# Altium schematic sheet Qunyin_mmWave_ESP32.SchDoc: mmWave_iwr6843aop
size 457 x 292 mm; DrawnBy: Wxd; Organization: Shanghai Qunyin; Address1: Xianxia Rd 601; Address2: Changning district; Address3: Shanghai; DocumentNumber: 5; SheetNumber: 5; SheetTotal: 6
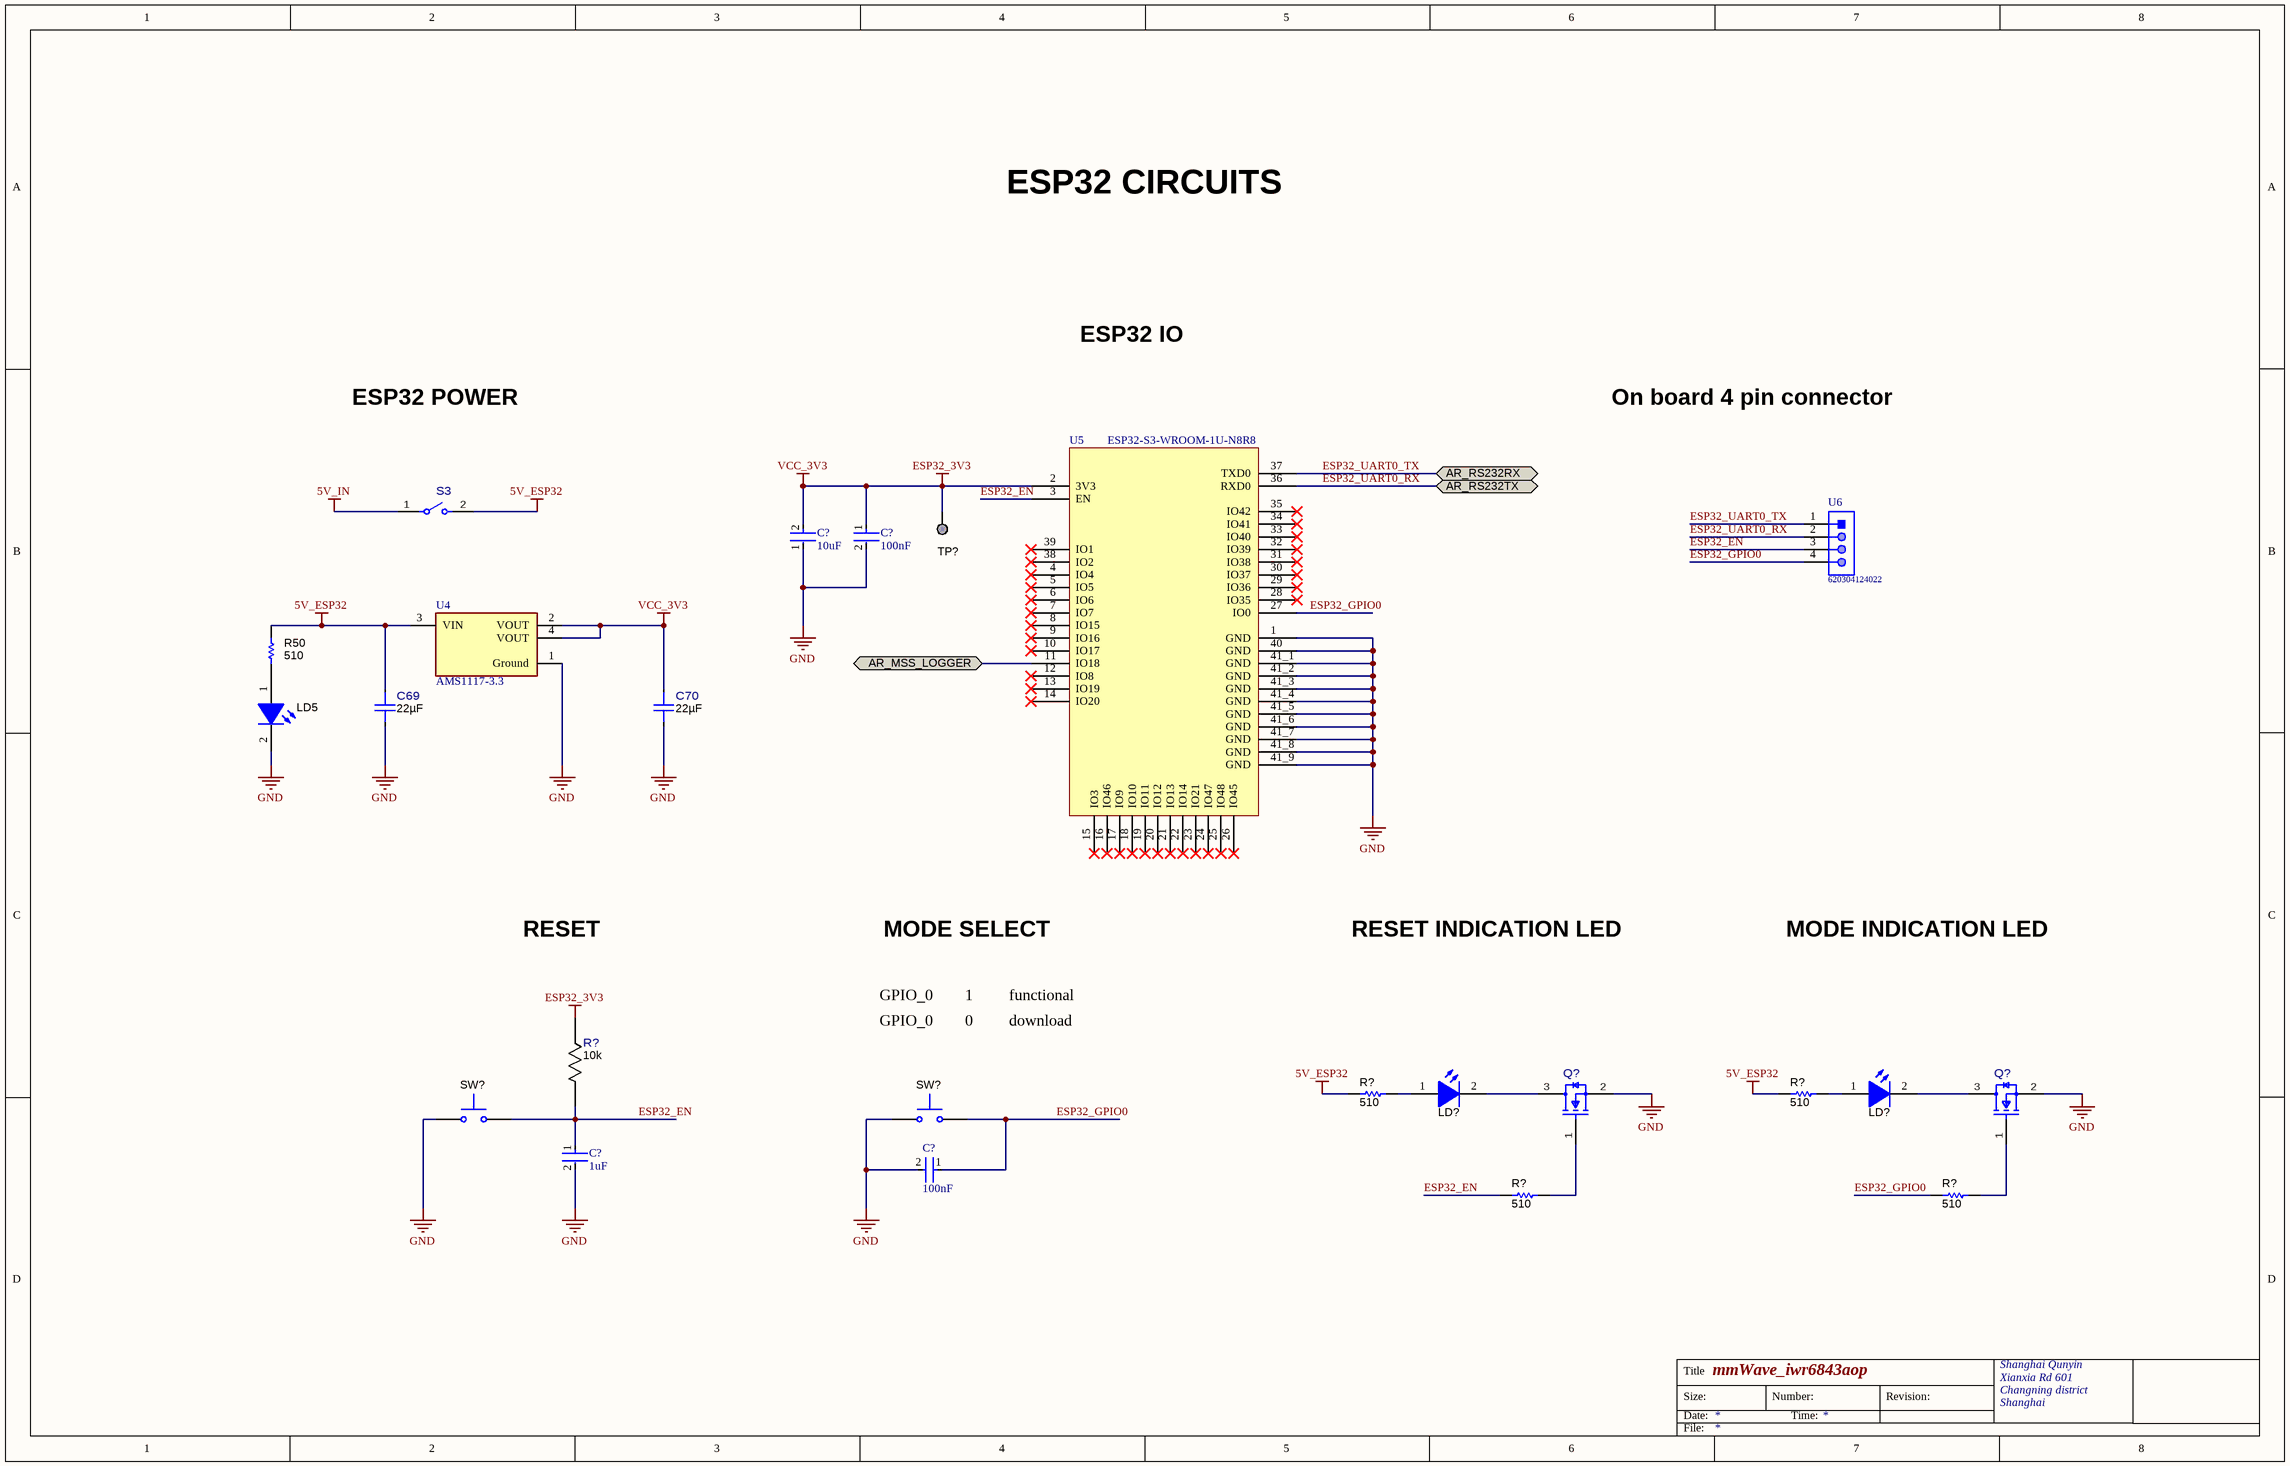
[diagram p0: Qunyin_mmWave_ESP32.SchDoc]

## Parts
(Parts that share a designator on the sheet are numbered #1, #2 ... from top to bottom, then left to right.)
C69  Cap_F: 22µF  [FP-CL05A226MQ5N6J8_0402-IPC_C]  (hidden comment: CL05A226MQ5N6J8)
C70  Cap_F: 22µF  [FP-CL05A226MQ5N6J8_0402-IPC_C]  (hidden comment: CL05A226MQ5N6J8)
C?#1  Capacitance: 10uF  [FP-C1608-080-0_1-MFG]  (hidden comment: C1608X5R1A106K080AC)
C?#2  Capacitance: 100nF  [FP-C1005-050-0_05-IPC_C]  (hidden comment: C1005X7R1H104K050BB)
C?#3  Capacitance: 1uF  [FP-0603-L_1_6_0_1-W_0_8_0-IPC_A]  (hidden comment: TMK107B7105KA-T)
C?#4  Capacitance: 100nF  [FP-C1005-050-0_05-IPC_C]  (hidden comment: C1005X7R1H104K050BB)
LD5  APHHS1005CGCK  [APHHS1005_Green]  (value not drawn)
LD?#1  APHHS1005CGCK  [APHHS1005_Green]  (value not drawn)
LD?#2  APHHS1005CGCK  [APHHS1005_Green]  (value not drawn)
Q?#1  BSS123-7-F  [FP-BSS123-7-F_SOT23-IPC_C]  (value not drawn)
Q?#2  BSS123-7-F  [FP-BSS123-7-F_SOT23-IPC_C]  (value not drawn)
R50  value 510  [0201L]  (hidden comment: RC0201JR-07510RL)
R?#1  Res_ohm: 10k  [FP-RR0306P-103-D_0201-IPC_C]  (hidden comment: RR0306P-103-D)
R?#2  value 510  [0201L]  (hidden comment: RC0201JR-07510RL)
R?#3  value 510  [0201L]  (hidden comment: RC0201JR-07510RL)
R?#4  value 510  [0201L]  (hidden comment: RC0201JR-07510RL)
R?#5  value 510  [0201L]  (hidden comment: RC0201JR-07510RL)
S3  CHS-01TA  [FP-CHS-01TA_SMT_SW_5MM4_2MM5-MFG]  (value not drawn)
SW?#1  B3U-1000P  [SW_B3U-1000P]  (value not drawn)
SW?#2  B3U-1000P  [SW_B3U-1000P]  (value not drawn)
TP?  TESTPOINT  [TP_25MIL-SMT]  (value not drawn)  (no BOM)
U4  AMS1117-3.3  [FP-AMS1117-IPC_C]
U5  ESP32-S3-WROOM-1U-N8R8  [XCVR_ESP32-S3-WROOM-1U]
U6  620304124022  [620304124022]

## Ports
AR_MSS_LOGGER (bidir), AR_RS232RX (bidir), AR_RS232TX (bidir)

## Nets
5V_ESP32: C69.1 R50.1 R?#2.1 R?#3.1 S3.2 U4.3(VIN)
5V_IN: S3.1
ESP32_3V3: C70.1 C?#1.2 C?#2.1 R?#1.1 TP?.1 U4.2(VOUT) U4.4(VOUT) U5.2(3V3)  [also labelled VCC_3V3]
GND: C69.2 C70.2 C?#1.1 C?#2.2 C?#3.2 C?#4.2 LD5.2(K) Q?#1.2(S) Q?#2.2(S) SW?#1.2 SW?#2.2 U4.1(Ground) U5.1(GND) U5.40(GND) U5.41_1(GND) U5.41_2(GND) U5.41_3(GND) U5.41_4(GND) U5.41_5(GND) U5.41_6(GND) U5.41_7(GND) U5.41_8(GND) U5.41_9(GND)
AR_MSS_LOGGER: U5.11(IO18) ; port AR_MSS_LOGGER
ESP32_EN: C?#3.1 R?#1.2 R?#4.1 SW?#1.1 U5.3(EN) U6.3
ESP32_GPIO0: C?#4.1 R?#5.1 SW?#2.1 U5.27(IO0) U6.4
ESP32_UART0_RX: U5.36(RXD0) U6.2 ; port AR_RS232TX
ESP32_UART0_TX: U5.37(TXD0) U6.1 ; port AR_RS232RX
NetLD5_1: LD5.1(A) R50.2
NetLD?#1_1: LD?#1.1(A) R?#2.2
NetLD?#1_2: LD?#1.2(K) Q?#1.3(D)
NetLD?#2_1: LD?#2.1(A) R?#3.2
NetLD?#2_2: LD?#2.2(K) Q?#2.3(D)
NetQ?#1_1: Q?#1.1(G) R?#4.2
NetQ?#2_1: Q?#2.1(G) R?#5.2

Not connected (* = marked no-connect by the designer): U5 4(IO4)* 5(IO5)* 6(IO6)* 7(IO7)* 8(IO15)* 9(IO16)* 10(IO17)* 12(IO8)* 13(IO19)* 14(IO20)* 15(IO3)* 16(IO46)* 17(IO9)* 18(IO10)* 19(IO11)* 20(IO12)* 21(IO13)* 22(IO14)* 23(IO21)* 24(IO47)* 25(IO48)* 26(IO45)* 28(IO35)* 29(IO36)* 30(IO37)* 31(IO38)* 32(IO39)* 33(IO40)* 34(IO41)* 35(IO42)* 38(IO2)* 39(IO1)*

## Notes on the sheet
- ESP32 CIRCUITS
- ESP32 IO
- ESP32 POWER
- On board 4 pin connector
- RESET
- MODE SELECT
- RESET INDICATION LED
- MODE INDICATION LED
- GPIO_0        1         functional
- GPIO_0        0         download
- Title
- Size:
- Date:
- Number:
- Time:
- Revision:
- File:

## Library data of the parts
C69 C70 = CMP-0089043-3: CAP CER 22UF 6.3V X5R 0402; Manufacturer: Samsung Electro-Mechanics; TempCo: 15%; AEC Qualified: No; Tolerance_%: 20%; SizeZ_mm: 0.55mm; ComponentLink1URL: http://www.samsungsem.com/kr/support/library/product-catalog/__icsFiles/afieldfile/2018/11/28/MLCC.pdf; RoHS: TRUE; PartNumber: CL05A226MQ5N6J8; ComponentLink1Description: Datasheet; PackageReference: 0402; VDC_V: 6.3V; ValueDisplayed: 22uF; Part Number: CL05A226MQ5N6J8
C?#1 = CMP-2000-04979-3: Multilayer Ceramic Capacitors 10μF ±10% 10V X5R SMD 0603; Dielectric Material: Ceramic; Construction: Flat; Height: 0.8mm; Thickness: 0.035inch; Case Code (Metric): 1608; Radiation Hardening: No; Number of Pins: 2; Voltage Rating (DC): 10V; Depth: 0.8mm; Voltage: 10V; RoHS Compliant: Yes; Voltage Rating: 10V; Package Quantity: 1; Resistor Type: Ceramic; Termination: SMD/SMT; Lead Free: Lead Free; REACH SVHC: No SVHC; Tolerance: 10%; Mount: Surface Mount; Series: C; Packaging: Tape and Reel; Width: 0.8mm; Dielectric: X5R; Weight: 7.1E-05oz; Length: 1.6mm; Max Operating Temperature: 85°C; Case Code (Imperial): 0603; Case/Package: 0603; Min Operating Temperature: -55°C
C?#2 C?#4 = CMP-2000-05393-2: Multilayer Ceramic Capacitors 100nF ±10% 50V X7R SMD 0402; Voltage: 50V; Dielectric Material: Ceramic; Min Operating Temperature: -55°C; Depth: 0.5mm; Radiation Hardening: No; RoHS Compliant: Yes; Voltage Rating (DC): 50V; Lead Free: Lead Free; Resistor Type: Ceramic; Height: 0.5mm; Dielectric: X7R; Thickness: 0.022inch; Case/Package: 0402; Case Code (Metric): 1005; Termination: SMD/SMT; Packaging: Tape and Reel; Max Operating Temperature: 125°C; Mount: Surface Mount; Package Quantity: 1; Width: 0.02inch; Weight: 2.3E-05oz; Voltage Rating: 50V; Tolerance: 10%; Construction: Flat; Case Code (Imperial): 0402; Length: 1mm; REACH SVHC: No SVHC; Series: C
C?#3 = CMP-2000-07259-3: None; Voltage Rating (DC): 25V; Dielectric: X7R; Tolerance: 10%; Height: 0.8mm; Case Code (Metric): 1608; Max Operating Temperature: 125°C; Case Code (Imperial): 0603; Case/Package: 0603; Resistor Type: Ceramic; Halogen Free: Halogen Free; Series: M; Voltage Rating: 25V; Number of Pins: 2; Depth: 0.8mm; RoHS Compliant: Yes; Mount: Surface Mount; Min Operating Temperature: -55°C; Length: 1.6mm; Contact Plating: Tin; Radiation Hardening: No; Width: 0.031inch; Construction: Flat; Thickness: 0.035inch; Packaging: Tape and Reel; Termination: SMD/SMT; REACH SVHC: No SVHC; Package Quantity: 1
LD5 LD?#1 LD?#2 = CMP-0067682-2: LED, Green, SMD; Manufacturer: Kingbright; Angle: 120.0; Power_TotalModule: 75mW; SizeZ_mm: 0.6; Vf_V: 2.1V; Vr_V: 5V; Io_A: 20mA; Ir_A: 10µA; SizeArea_mm2: 0.5; SizeAreaWB_mm2: 3.0; SizeX_mm: 1.0; Tjmax_C: 85°C; Value1: 0.075W; RoHS: Y; Color: Green; ComponentLink1Description: Datasheet link; ComponentLink1URL: http://www.kingbrightusa.com/images/catalog/SPEC/APHHS1005CGCK.pdf; PackageReference: 0402; PartNumber: APHHS1005CGCK; CompType: LED; MountType: SMT; SizeY_mm: 0.5; Type: ?; Value2: 2.1V; Value: Green
Q?#1 Q?#2 = CMP-0087176-1: MOSFET N-CH 100V 170MA SOT23-3; Manufacturer: Diodes Incorporated; AEC Qualified: No; ChMode: False; Rdson45_ohm: 6; SizeZ_mm: 1.1mm; Vgs_V: 20V; RoHS: TRUE; ComponentLink1Description: Datasheet; ComponentLink1URL: https://www.diodes.com/assets/Datasheets/ds30366.pdf; IdsMax_A: 170mA; PackageReference: SOT23; PartNumber: BSS123-7-F; Symbol Name: SYM-BSS123-7-F; VdsMax_V: 100V
R50 R?#2-R?#5 = CMP-0027137-1: RES, 510, 5%, 0.05 W, 0201; Manufacturer: Yageo America; AEC Category: Q200; AEC Qualified: N; EIA_Code: E24; Power_W: 50mW; SizeArea_mm2: 0.18; SizeX_mm: 0.6; SizeY_mm: 0.3; SizeZ_mm: 0.26; TempCo: 200 ppm/C; U/M: EA; Value2: 0.05W; Value_Code: 510R; VDC_V: 25V; RoHS: Y; AEC Grade: N/A; ComponentLink1Description: Datasheet link; ComponentLink1URL: http://www.yageo.com/documents/recent/PYu-RC_Group_51_RoHS_L_5.pdf; CompType: Resistor; LatestRevisionDate: 2017-03-09; MountType: SMT; PackageReference: 0201; PartNumber: RC0201JR-07510RL; Published: 2016-10-14; Publisher: Texas Instruments; Res_ohm: 510; Supplier 1: Digi-Key; Supplier 2: Mouser; Supplier Part Number 1: YAG2907CT-ND; Supplier Part Number 2: 603-RC0201JR-07510RL; Technology: Thick Film; Tolerance_%: 5%; Value1: 5%; ValueDisplayed: 510
R?#1 = CMP-0088002-1: 10 kOhms ±0.5% 0.05W, 1/20W Chip Resistor 0201 (0603 Metric)  Thin Film; Manufacturer: Susumu; AEC Qualified: No; Power_W: 50mW; SizeZ_mm: 0.26mm; Symbol Name: SYM-RR0306P-103-D; TempCo: 25ppm/°C; VDC_V: 15V; RoHS: TRUE; ComponentLink1Description: Datasheet; ComponentLink1URL: https://www.susumu.co.jp/common/pdf/n_catalog_partition05_en.pdf; PackageReference: 0201; PartNumber: RR0306P-103-D; Technology: Thin Film; Tolerance_%: 0.5%
S3 = CMP-0087181-1: SWITCH SLIDE DIP SPST 100MA 6V; Manufacturer: Nidec Copal Electronics; PositionCount: 1; SizeZ_mm: 2.5mm; Symbol Name: SYM-CHS-01TA; RoHS: TRUE; Circuit: SPST; ComponentLink1Description: Datasheet; ComponentLink1URL: https://www.nidec-copal-electronics.com/e/catalog/switch/chs.pdf; MountType: Surface Mount; PackageReference: SMT_SW_5MM4_2MM5; PartNumber: CHS-01TA; VDC_V: 6V
SW?#1 SW?#2 = CMP-0002150-2: SWITCH TACTILE SPST-NO 0.05A 12V; Manufacturer: Omron Electronic Components; CurrentRating_mA: 50A; PositionCount: 1; SwitchFunction: Off-Mom; RoHS: Y; Circuit: SPST-NO; ComponentLink1Description: Datasheet URL; ComponentLink1URL: http://www.components.omron.com/components/web/PDFLIB.nsf/0/2DD3893C7DD33E9E862572900079E9D6/$file/B3U_1110.pdf; CompType: Switch; LatestRevisionDate: 2017-03-09; MountType: SMT; Orientation: Top Actuated; PackageReference: 3x1.6x2.5mm; PartNumber: B3U-1000P; Publisher: Texas Instruments; Supplier 1: Digi-Key; Supplier 2: Newark; Supplier 3: Mouser; Supplier Part Number 1: SW1020CT-ND; Supplier Part Number 2: 34M5295; Supplier Part Number 3: 653-B3U-1000P; VDC_V: 12V
TP? = CMP-0078143-3: TEST POINT.  No entry in BOM.; CompType: Testpoint; Manufacturer: N/A; PackageReference: N/A; PartNumber: N/A; Library Reference: TESTPOINT
U4 = CMP-209535-000001-1: LDO Voltage Regulators 1A, 3.3V; Manufacturer: Advanced Monolithic Systems; Dropout Voltage: 1.1V; Output Type: Fixed; Nominal Supply Current: 5mA; Max Power Dissipation: 1.2W; Max Supply Voltage: 15V; Number Of Outputs: 1; Standoff Height: 0.64mm; Max Junction Temp: +125°C; Height: 1.8mm; Package: AMS1117; Device Class L2: Power Management ICs; ComponentLink2Description: Datasheet; ComponentLink2URL: http://www.advanced-monolithic.com/pdf/ds1117.pdf; Category: IC; RoHS: TRUE; Automotive: No; Device Class L1: Integrated Circuits (ICs); Output Current: 1A; Device Class L3: Voltage Regulators - Linear; Temperature: -40°C to +125°C; Output Voltage: 3.3V; Manufacturer Part Number: AMS1117-3.3; Temperature Range Low: -40°C; Octopart: https://octopart.com/ams1117-3.3-advanced+monolithic+systems-25899300; Lead Free: Yes; Ipc Land Pattern Name: SOT229P700X180-4; Temperature Range High: +125°C
U6 = CMP-1502-00662-1: Male Shrouded Header WR-WTB, SMT, Vertical, pitch 2 mm, 1 x 4 position; Manufacturer: Wurth Elektronik; Working Voltage: 100VAC; Contact Resistance: 20mOhm; Pitch: 2mm; Position: 1x4; Part Number: 620304124022; Orientation: Vertical; Publisher: WurthElektronik; Packaging: TapeandReel; Gender: Male; Mounting Technology: SMT; Operating Temperature: -25to85degC; Manufacturer URL: http://www.we-online.de; Package Reference: 620304124022; Datasheet URL: https://katalog.we-online.de/em/datasheet/6203xx124022.pdf